# Altium schematic sheet GPIO_&_Arduino_ Connectors.SchDoc: GPIO_&_Arduino_ Connectors
size A3; CompanyName: STMicroelectronics; Organization: Microcontrollers Division; Address1: 12, Rue Jules HOROWITZ; Address2: 38019 Grenoble; Address3: FRANCE; DocumentNumber: MB1272; Revision: A-01; SheetNumber: 10; SheetTotal: 15; Project: STM32MP15-DISCO PI; DocumentName: GPIO_&_ARDUINO_ Connectors.SchDoc
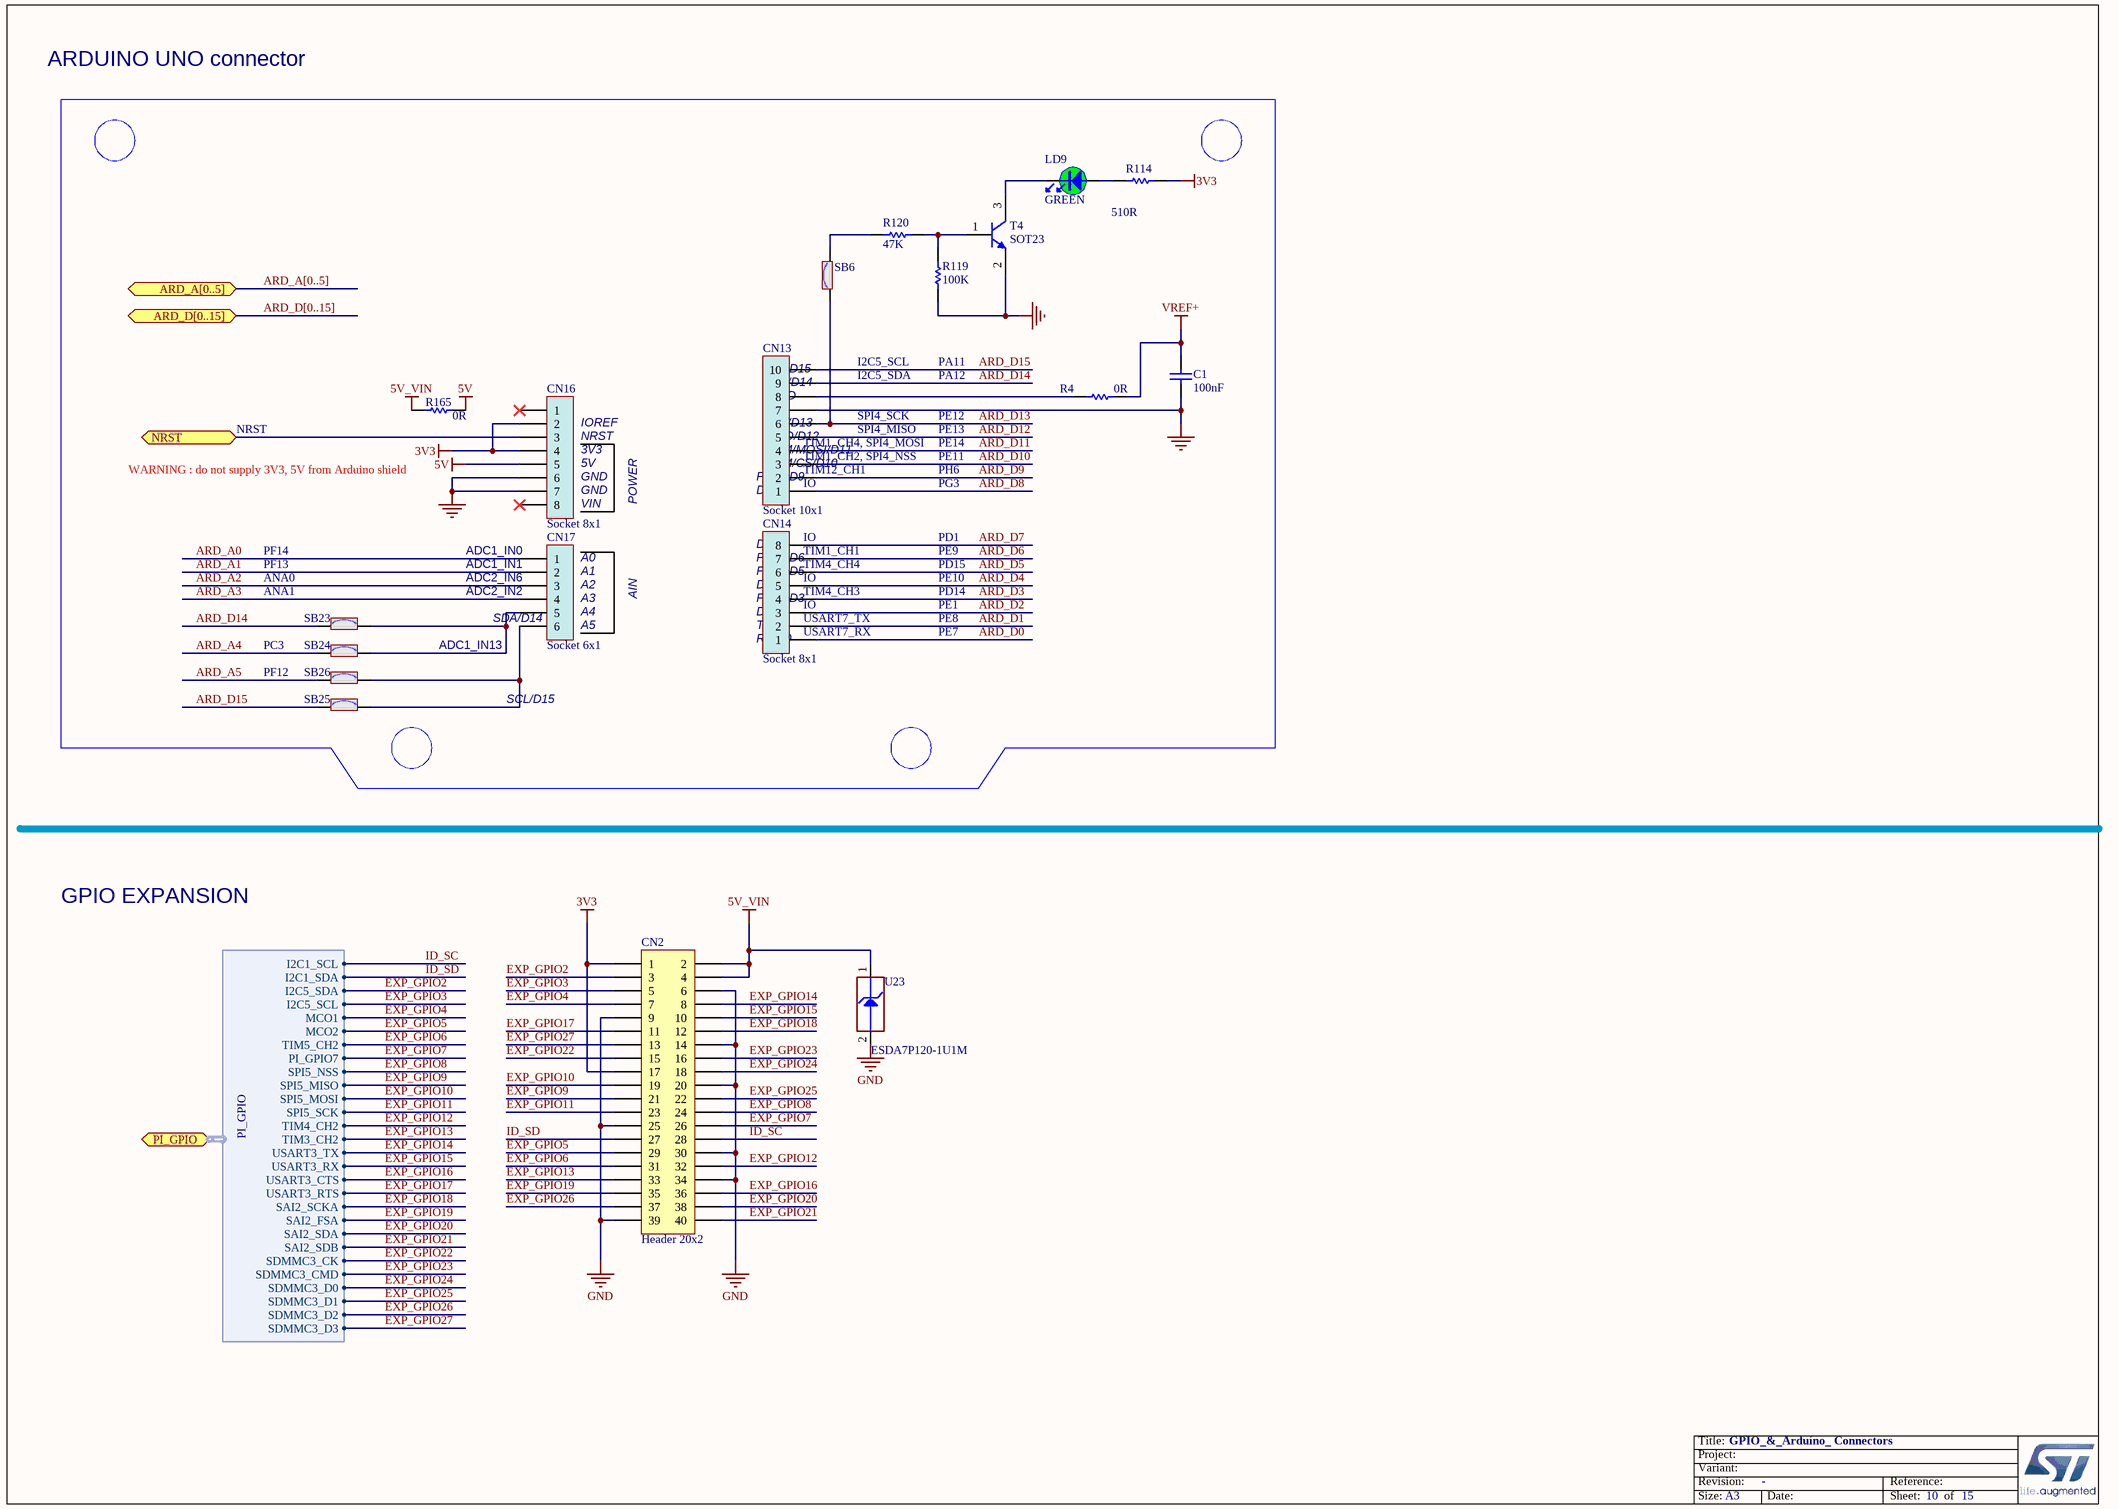
[diagram p0: GPIO_&_Arduino_ Connectors.SchDoc]

## Parts
C1  value 100nF  [C0402]
CN2  value Header 20x2  [CON_SAMTEC_TSW-120-07-G-D]
CN13  value Socket 10x1  [CON_SAMTEC_SSW-110-22-X-S-VS]
CN14  value Socket 8x1  [CON_SAMTEC_SSW-108-22-X-S-VS]
CN16  value Socket 8x1  [CON_SAMTEC_SSW-108-22-X-S-VS]
CN17  value Socket 6x1  [CON_SAMTEC_SSW-106-22-X-S-VS]
LD9  value GREEN  [LED_0603_GREEN]
R4  value 0R  [R0402]
R114  value 510R  [R0402]
R119  value 100K  [R0402]
R120  value 47K  [R0402]
R165  value 0R  [R0402]
SB6  (no value)  [SOLDER-BRIDGE_R0603-0R]
SB23  SB_ON  [SOLDER-BRIDGE_R0603-0R]  (value not drawn)
SB24  (no value)  [SOLDER-BRIDGE_R0603-0R]
SB25  SB_ON  [SOLDER-BRIDGE_R0603-0R]  (value not drawn)
SB26  (no value)  [SOLDER-BRIDGE_R0603-0R]
T4  value SOT23  [NPN_SOT23]
U23  value ESDA7P120-1U1M  [ESD_QFN1610_2N_1K_2A]  (hidden comment: ​Footprint needed DFN105P160X60-2N)

## Ports
ARD_A[0..5], ARD_D[0..15], NRST (bidir), PI_GPIO (harness PI_GPIO)

## Harnesses
PI_GPIO: I2C1_SCL, I2C1_SDA, I2C5_SDA, MCO1, MCO2, TIM5_CH2, PI_GPIO7, SPI5_NSS, SPI5_MISO, SPI5_MOSI, SPI5_SCK, TIM4_CH2, TIM3_CH2, USART3_TX, USART3_RX, USART3_CTS, USART3_RTS, SDMMC3_CK, SDMMC3_CMD, SDMMC3_D0, SDMMC3_D1, SDMMC3_D2, SDMMC3_D3, I2C5_SCL, SAI2_SCKA, SAI2_FSA, SAI2_SDA, SAI2_SDB

## Nets
3V3: CN2.1 CN2.17 CN16.2 CN16.4 R114.2
5V: CN16.5 R165.2
5V_VIN: CN2.2 CN2.4 R165.1 U23.1(IO1)
GND: C1.1 CN2.6 CN2.9 CN2.14 CN2.20 CN2.25 CN2.30 CN2.34 CN2.39 CN13.7 CN16.6 CN16.7 R119.1 T4.2(E) U23.2(GND)
VREF+: C1.2 R4.2
ARD_A0: CN17.1
ARD_A1: CN17.2
ARD_A2: CN17.3
ARD_A3: CN17.4
ARD_A4: SB24.1
ARD_A5: SB26.1
ARD_D0: CN14.1
ARD_D1: CN14.2
ARD_D2: CN14.3
ARD_D3: CN14.4
ARD_D4: CN14.5
ARD_D5: CN14.6
ARD_D6: CN14.7
ARD_D7: CN14.8
ARD_D8: CN13.1
ARD_D9: CN13.2
ARD_D10: CN13.3
ARD_D11: CN13.4
ARD_D12: CN13.5
ARD_D13: CN13.6 SB6.1
ARD_D14: CN13.9 SB23.1
ARD_D15: CN13.10 SB25.1
EXP_GPIO2: CN2.3 ; port PI_GPIO.I2C5_SDA
EXP_GPIO3: CN2.5 ; port PI_GPIO.I2C5_SCL
EXP_GPIO4: CN2.7 ; port PI_GPIO.MCO1
EXP_GPIO5: CN2.29 ; port PI_GPIO.MCO2
EXP_GPIO6: CN2.31 ; port PI_GPIO.TIM5_CH2
EXP_GPIO7: CN2.26 ; port PI_GPIO.PI_GPIO7
EXP_GPIO8: CN2.24 ; port PI_GPIO.SPI5_NSS
EXP_GPIO9: CN2.21 ; port PI_GPIO.SPI5_MISO
EXP_GPIO10: CN2.19 ; port PI_GPIO.SPI5_MOSI
EXP_GPIO11: CN2.23 ; port PI_GPIO.SPI5_SCK
EXP_GPIO12: CN2.32 ; port PI_GPIO.TIM4_CH2
EXP_GPIO13: CN2.33 ; port PI_GPIO.TIM3_CH2
EXP_GPIO14: CN2.8 ; port PI_GPIO.USART3_TX
EXP_GPIO15: CN2.10 ; port PI_GPIO.USART3_RX
EXP_GPIO16: CN2.36 ; port PI_GPIO.USART3_CTS
EXP_GPIO17: CN2.11 ; port PI_GPIO.USART3_RTS
EXP_GPIO18: CN2.12 ; port PI_GPIO.SAI2_SCKA
EXP_GPIO19: CN2.35 ; port PI_GPIO.SAI2_FSA
EXP_GPIO20: CN2.38 ; port PI_GPIO.SAI2_SDA
EXP_GPIO21: CN2.40 ; port PI_GPIO.SAI2_SDB
EXP_GPIO22: CN2.15 ; port PI_GPIO.SDMMC3_CK
EXP_GPIO23: CN2.16 ; port PI_GPIO.SDMMC3_CMD
EXP_GPIO24: CN2.18 ; port PI_GPIO.SDMMC3_D0
EXP_GPIO25: CN2.22 ; port PI_GPIO.SDMMC3_D1
EXP_GPIO26: CN2.37 ; port PI_GPIO.SDMMC3_D2
EXP_GPIO27: CN2.13 ; port PI_GPIO.SDMMC3_D3
ID_SC: CN2.28 ; port PI_GPIO.I2C1_SCL
ID_SD: CN2.27 ; port PI_GPIO.I2C1_SDA
NRST: CN16.3 ; port NRST
NetCN13_8: CN13.8 R4.1
NetCN17_5: CN17.5 SB23.2 SB24.2
NetCN17_6: CN17.6 SB25.2 SB26.2
NetLD9_1: LD9.1 R114.1
NetLD9_2: LD9.2 T4.3(C)
NetR119_2: R119.2 R120.2 T4.1(B)
NetR120_1: R120.1 SB6.2

Not connected (* = marked no-connect by the designer): CN16 1* 8*

## Buses and harness runs
bus ARD_A[0..5] = port ARD_A[0..5]
bus ARD_D[0..15] = port ARD_D[0..15]

## Notes on the sheet
- ARDUINO UNO connector
- (near CN13) SCL/D15
- I2C5_SCL
- I2C5_SDA
- PA11
- PA12
- NRST
- (near CN16) IOREF
- (near CN16) NRST
- (near CN16) 3V3
- (near CN13) SDA/D14
- (near CN13) SCK/D13
- (near CN13) MISO/D12
- (near CN13) PWM/MOSI/D11
- (near CN13) AVDD
- (near CN13) GND
- (near CN13) TIM1_CH4, SPI4_MOSI
- SPI4_SCK
- SPI4_MISO
- PE14
- PE13
- PE12
- WARNING : do not supply 3V3, 5V from Arduino shield
- (near CN16) 5V
- (near CN16) GND
- (near CN16) VIN
- POWER
- (near CN13) D8
- (near CN13) PWM/D9
- (near CN13) PWM/CS/D10
- (near CN13) TIM12_CH1
- (near CN13) TIM1_CH2, SPI4_NSS
- (near CN13) IO
- PG3
- PH6
- PE11
- ANA0
- PF14
- PF13
- (near CN17) ADC2_IN6
- (near CN17) ADC1_IN1
- ADC1_IN0
- (near CN17) A0
- (near CN17) A1
- (near CN17) A2
- (near CN14) D4
- (near CN14) PWM/D5
- (near CN14) PWM/D6
- (near CN14) D7
- (near CN14) TIM4_CH4
- (near CN14) TIM1_CH1
- (near CN14) IO
- PE10
- PD15
- PE9
- PD1
- ANA1
- PC3
- ADC1_IN13
- (near CN17) ADC2_IN2
- SDA/D14
- (near CN17) A3
- (near CN17) A4
- (near CN17) A5
- AIN
- (near CN14) RX/D0
- (near CN14) TX/D1
- (near CN14) D2
- (near CN14) PWM/D3
- (near CN14) USART7_RX
- (near CN14) USART7_TX
- (near CN14) TIM4_CH3
- PE7
- PE8
- PE1
- PD14
- PF12
- SCL/D15
- GPIO EXPANSION
- Title:
- Project:
- Size:
- Revision:
- Variant:
- -
- Date:
- Reference:
- Sheet:
- of

## Library data of the parts
C1 = MCD-00006: Capacitor,100nF,16V,X7R,10%,0402; Manufacturer_Part_Number: CC0402KRX7R7BB104; Manufacturer: YAGEO; Alternate_Manufacturer: MURATA; Alternate_Manufacturer_Part_Number: GCM155R71C104KA55D; Provided_By: SUBCO; Initial_Board_Reference: mb1274; Internal_Part_Number: MCD-00006; ComponentLink1Description: Datasheet; ECCN_US: n/a; ECCN_EU: n/a; Status: Released; Part_Type: Capacitor; Package: C0402; ComponentLink1URL: http://tunmcdsvn.tun.st.com/Component_Datasheet_Library/Trunk/Capacitors/Yageo_Multilayer_Capacitor_X7R_series_100pF_to_22uF
CN2 = MCD-00302: Header, 20x2, 2.54mm, VR, TH, Height 5.84mm/2.54mm; Manufacturer_Part_Number: TSW-120-07-G-D; Manufacturer: SAMTEC; Part_Type: Connector; Provided_By: SUBCO; Initial_Board_Reference: mb1272; Internal_Part_Number: MCD-00302; ComponentLink1Description: Datasheet; ComponentLink1URL: http://tunmcdsvn.tun.st.com/Component_Datasheet_Library/Trunk/Connectors/Samtec_TSW-HTSW-series; ECCN_US: n/a; ECCN_EU: n/a; Status: Checked
CN13 = MCD-00301: Socket, 10x1, 2.54mm, VR, SMT, Height 9.78mm; Part_Type: Connector; Manufacturer_Part_Number: SSW-110-22-L-S-VS; Manufacturer: SAMTEC; Provided_By: SUBCO; Initial_Board_Reference: mb1272; Internal_Part_Number: MCD-00301; Status: Checked; ComponentLink1Description: Datasheet; ComponentLink1URL: http://tunmcdsvn.tun.st.com/Component_Datasheet_Library/Trunk/Connectors/Samtec_SSW_smt_series; ECCN_US: n/a; ECCN_EU: n/a
CN14 CN16 = MCD-00300: Socket, 8x1, 2.54mm, VR, SMT, Height 9.78mm; Manufacturer_Part_Number: SSW-108-22-L-S-VS; Manufacturer: SAMTEC; Part_Type: Connector; Provided_By: SUBCO; Initial_Board_Reference: mb1272; Internal_Part_Number: MCD-00300; ComponentLink1Description: Datasheet; ComponentLink1URL: http://tunmcdsvn.tun.st.com/Component_Datasheet_Library/Trunk/Connectors/Samtec_SSW_smt_series; ECCN_US: n/a; ECCN_EU: n/a; Status: Checked
CN17 = MCD-00299: Socket, 6x1, 2.54mm, VR, SMT, Height 9.78mm; Manufacturer_Part_Number: SSW-106-22-L-S-VS; Manufacturer: SAMTEC; Part_Type: Connector; Provided_By: SUBCO; Initial_Board_Reference: mb1272; Internal_Part_Number: MCD-00299; ComponentLink1Description: Datasheet; ComponentLink1URL: http://tunmcdsvn.tun.st.com/Component_Datasheet_Library/Trunk/Connectors/Samtec_SSW_smt_series; ECCN_US: n/a; ECCN_EU: n/a; Status: Checked
LD9 = MCD-00050: LED, Green, 0603; Manufacturer_Part_Number: 19-213SYGC/S530-E2/TR8; Manufacturer: EVERLIGHT; Part_Type: Display; ECCN_US: EAR99; ECCN_EU: NEC; Provided_By: SUBCO; Initial_Board_Reference: mb1274; Internal_Part_Number: MCD-00050; ComponentLink1Description: Datasheet; Status: Released; ComponentLink1URL: http://tunmcdsvn.tun.st.com/Component_Datasheet_Library/Trunk/Display/Everlight_SMD-LED-GREEN_19-213SYGC-S530-XX-TR8-v3.doc; Package: LED 0603
R4 R165 = MCD-00052: Resistor,0R,0402,5%,1/16W; Manufacturer_Part_Number: RC0402JR-070RL; Manufacturer: YAGEO; Provided_By: SUBCO; Initial_Board_Reference: mb1274; Internal_Part_Number: MCD-00052; ComponentLink1Description: Datasheet; ECCN_US: n/a; ECCN_EU: n/a; Status: Released; Part_Type: Resistor; ComponentLink1URL: http://tunmcdsvn.tun.st.com/Component_Datasheet_Library/Trunk/Resistors/Yageo_Resistor_RC0402-series; Package: R0402
R114 = MCD-00064: Resistor,510R,0402,1%,1/16W; Manufacturer_Part_Number: RC0402FR-07510RL; Manufacturer: YAGEO; Provided_By: SUBCO; Initial_Board_Reference: mb1274; Internal_Part_Number: MCD-00064; ComponentLink1Description: Datasheet; ECCN_US: n/a; ECCN_EU: n/a; Status: Released; Part_Type: Resistor; ComponentLink1URL: http://tunmcdsvn.tun.st.com/Component_Datasheet_Library/Trunk/Resistors/Yageo_Resistor_RC0402-series; Package: R0402
R119 = MCD-00059: Resistor,100K,0402,1%,1/16W; Manufacturer_Part_Number: RC0402FR-07100KL; Manufacturer: YAGEO; Alternate_Manufacturer_Part_Number: RT0402FRE07100KL; Provided_By: SUBCO; Initial_Board_Reference: mb1274; Internal_Part_Number: MCD-00059; Alternate_Manufacturer: YAGEO; ComponentLink1Description: Datasheet; ECCN_US: n/a; ECCN_EU: n/a; Status: Released; Part_Type: Resistor; ComponentLink1URL: http://tunmcdsvn.tun.st.com/Component_Datasheet_Library/Trunk/Resistors/Yageo_Resistor_RC0402-series; Package: R0402
R120 = MCD-00063: Resistor,47K,0402,1%,1/16W; Manufacturer_Part_Number: RC0402FR-0747KL; Manufacturer: YAGEO; Provided_By: SUBCO; Initial_Board_Reference: mb1274; Internal_Part_Number: MCD-00063; ComponentLink1Description: Datasheet; ECCN_US: n/a; ECCN_EU: n/a; Status: Released; Part_Type: Resistor; ComponentLink1URL: http://tunmcdsvn.tun.st.com/Component_Datasheet_Library/Trunk/Resistors/Yageo_Resistor_RC0402-series; Package: R0402
SB6 SB24 SB26 = MCD-00071: Solder Bridge ON; Part_Type: Mechanical; Manufacturer: YAGEO; Manufacturer_Part_Number: RC0603JR-070RL; Provided_By: SUBCO; Initial_Board_Reference: mb1274; Internal_Part_Number: MCD-00071; ECCN_US: n/a; ECCN_EU: n/a; Status: Released; ComponentLink1Description: Datasheet; ComponentLink1URL: http://tunmcdsvn.tun.st.com/Component_Datasheet_Library/Trunk/Resistors/Yageo_Resistor_RC0603-series; Package: SB0603
SB23 SB25 = MCD-00071: Solder Bridge ON; Part_Type: Mechanical; Manufacturer: YAGEO; Manufacturer_Part_Number: RC0603JR-070RL; Provided_By: SUBCO; Initial_Board_Reference: MB1274; Internal_Part_Number: MCD-00071; ECCN_US: n/a; ECCN_EU: n/a; Status: Released; ComponentLink1Description: Datasheet; ComponentLink1URL: http://tunmcdsvn.tun.st.com/Component_Datasheet_Library/Trunk/Resistors/Yageo_Resistor_RC0603-series; Package: SB0603
T4 = MCD-00073: NPN Bipolar Transistor; Manufacturer_Part_Number: BSR14; Manufacturer: ON SEMICONDUCTOR; Part_Type: IC; Alternate_Manufacturer_Part_Number: MMBT2222ALT1G / MMBT2222ALT3G; ECCN_US: EAR99; ECCN_EU: NEC; Provided_By: SUBCO; Initial_Board_Reference: mb1274; Revision: *; Internal_Part_Number: MCD-00073; ComponentLink1Description: Datasheet; Status: Released; ComponentLink1URL: http://tunmcdsvn.tun.st.com/Component_Datasheet_Library/Trunk/IC/NXP_Transistor_BSR14; Alternate_Manufacturer: ON SEMICONDUCTOR
U23 = MCD-01026: High power transient voltage suppressor; Part_Type: Diode; Manufacturer: STMICROELECTRONICS; BMS_Part_Number: 9179046; ECCN_US: EAR99; ECCN_EU: NEC; Provided_By: SUBCO with ST control; Initial_Board_Reference: MB1378; Internal_Part_Number: MCD-01026; Status: Released; Manufacturer_Part_Number: ESDA7P120-1U1M; Package: QFN1610; ComponentLink1Description: Datasheet; ComponentLink1URL: http://tunmcdsvn.tun.st.com/Component_Datasheet_Library/Trunk/Diodes/STM_ESD_ESDA7P120-1U1M